# Altium schematic sheet B38_Shunt.SchDoc
size A
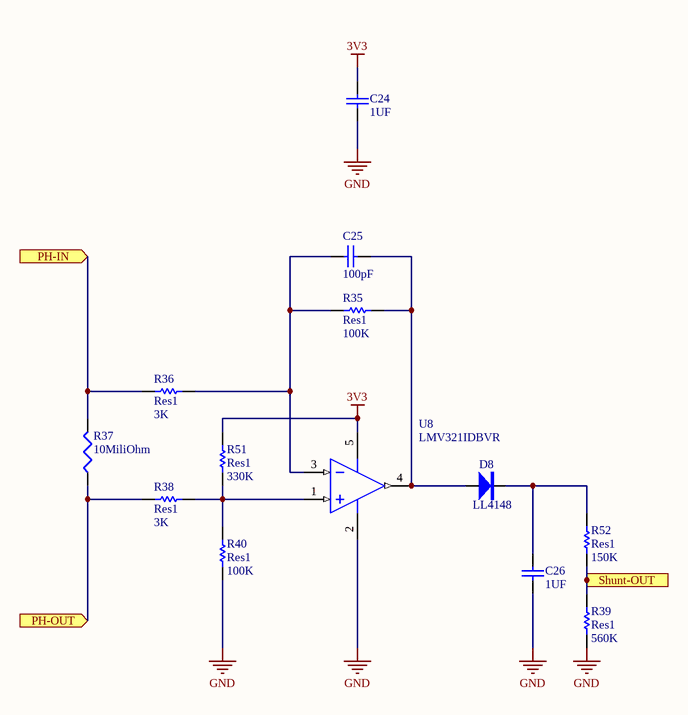
[diagram p0: B38_Shunt.SchDoc]

## Parts
C24  1UF  [CAP0603]
C25  100pF  [CAP0603]
C26  1UF  [CAP0603]
D8  LL4148  [sod-123]
R35  Res1  value 100K  [RES0603]
R36  Res1  value 3K  [RES0603]
R37  10MiliOhm  [SHUNT-10MM]
R38  Res1  value 3K  [RES0603]
R39  Res1  value 560K  [RES0603]
R40  Res1  value 100K  [RES0603]
R51  Res1  value 330K  [RES0603]
R52  Res1  value 150K  [RES0603]
U8  LMV321IDBVR  [SOT23-5]

## Ports
PH-IN (in), PH-OUT (in), Shunt-OUT (out)

## Nets
3V3: C24.1 R51.2 U8.5(VCC+)
GND: C24.2 C26.2 R39.1 R40.1 U8.2(GND)
PH-IN: R36.1 R37.2 ; port PH-IN
PH-OUT: R37.1 R38.1 ; port PH-OUT
Shunt-OUT: R39.2 R52.1 ; port Shunt-OUT
NetC25_1: C25.1 R35.1 R36.2 U8.3(IN-)
NetC25_2: C25.2 D8.1(A) R35.2 U8.4(OUT)
NetC26_1: C26.1 D8.2(K) R52.2
NetR38_2: R38.2 R40.2 R51.1 U8.1(IN+)

## Library data of the parts
C24-C26 = CAP-SMT: 1UF ±5% 50V X7R 0603 Multilayer Ceramic Capacitors MLCC - SMD/SMT
  C24 C26: Value: 1UF
  C25: Value: 100pF
D8 = DIODE
R35 R36 R38-R40 R51 R52 = Res1: Resistor; Published: 8-Jun-2000; LatestRevisionDate: 17-Jul-2002; LatestRevisionNote: Re-released for DXP Platform.; PackageReference: AXIAL-0.3; Publisher: Altium Limited; PackageDescription: Axial Device, Thru-Hole; 2 Leads; 0.3 in Pin Spacing
R37 = RES: Resistor
U8 = LM741: Wide Bandwidth JFET Input Operational Amplifier